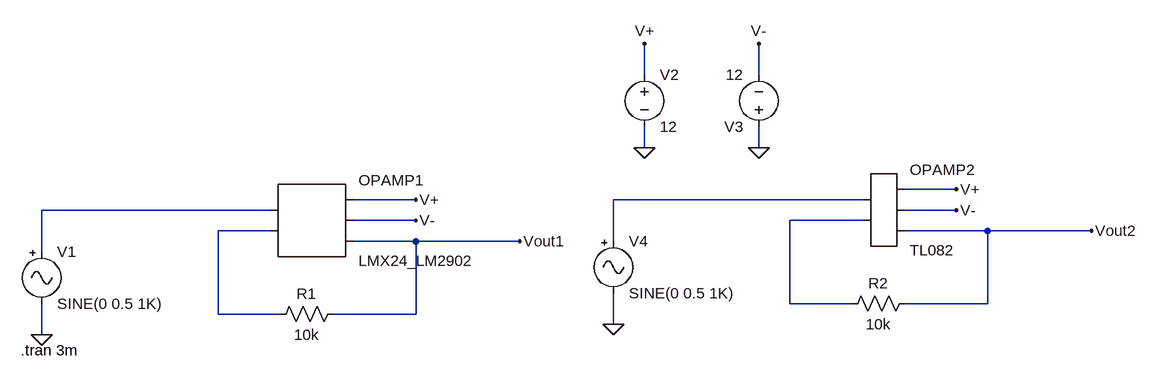
[diagram p0: schematic relat11.asc]
relat11.asc, the LTspice schematic file:
Version 4
SHEET 1 1748 680
WIRE 976 -144 976 -192
WIRE 1152 -144 1152 -192
WIRE 976 -32 976 -64
WIRE 1152 -32 1152 -64
WIRE 1456 32 1376 32
WIRE 624 48 528 48
WIRE 1312 48 928 48
WIRE 400 64 48 64
WIRE 1456 64 1376 64
WIRE 624 80 528 80
WIRE 1312 80 1200 80
WIRE 400 96 320 96
WIRE 1504 96 1376 96
WIRE 1664 96 1504 96
WIRE 624 112 528 112
WIRE 784 112 624 112
WIRE 928 112 928 48
WIRE 48 128 48 64
WIRE 1200 208 1200 80
WIRE 1296 208 1200 208
WIRE 1504 208 1504 96
WIRE 1504 208 1376 208
WIRE 320 224 320 96
WIRE 416 224 320 224
WIRE 624 224 624 112
WIRE 624 224 496 224
WIRE 928 240 928 192
WIRE 48 256 48 208
FLAG 48 256 0
FLAG 976 -32 0
FLAG 1152 -32 0
FLAG 928 240 0
FLAG 784 112 Vout1
FLAG 1664 96 Vout2
FLAG 976 -192 V+
FLAG 624 80 V-
FLAG 1152 -192 V-
FLAG 1456 32 V+
FLAG 1456 64 V-
FLAG 624 48 V+
SYMBOL Misc\\signal 48 112 R0
WINDOW 123 0 0 Left 0
WINDOW 39 0 0 Left 0
SYMATTR InstName V1
SYMATTR Value SINE(0 0.5 1K)
SYMBOL AutoGenerated\\LMX24_LM2902 464 80 R0
SYMATTR InstName OPAMP1
SYMBOL voltage 976 -160 R0
WINDOW 123 0 0 Left 0
WINDOW 39 0 0 Left 0
SYMATTR InstName V2
SYMATTR Value 12
SYMBOL voltage 1152 -48 R180
WINDOW 123 0 0 Left 0
WINDOW 39 0 0 Left 0
SYMATTR InstName V3
SYMATTR Value 12
SYMBOL res 512 208 R90
WINDOW 0 0 56 VBottom 2
WINDOW 3 32 56 VTop 2
SYMATTR InstName R1
SYMATTR Value 10k
SYMBOL Misc\\signal 928 96 R0
WINDOW 123 0 0 Left 0
WINDOW 39 0 0 Left 0
SYMATTR InstName V4
SYMATTR Value SINE(0 0.5 1K)
SYMBOL res 1392 192 R90
WINDOW 0 0 56 VBottom 2
WINDOW 3 32 56 VTop 2
SYMATTR InstName R2
SYMATTR Value 10k
SYMBOL AutoGenerated\\TL082 1344 64 R0
SYMATTR InstName OPAMP2
TEXT 16 280 Left 2 !.tran 3m

The netlist it stands for:
* relat11.asc
V1 N002 0 SINE(0 0.5 1K)
* OPAMP1: LMX24_LM2902 (symbol AutoGenerated\LMX24_LM2902 not available, pins judged from their places): pin1=N002 pin2=N004 pin3=V+ pin4=V- pin5=Vout1
V2 V+ 0 12
V3 0 V- 12
R1 Vout1 N004 10k
V4 N001 0 SINE(0 0.5 1K)
R2 Vout2 N003 10k
* OPAMP2: TL082 (symbol AutoGenerated\TL082 not available, pins judged from their places): pin1=N001 pin2=N003 pin3=V+ pin4=V- pin5=Vout2
.tran 3m
.backanno
.end